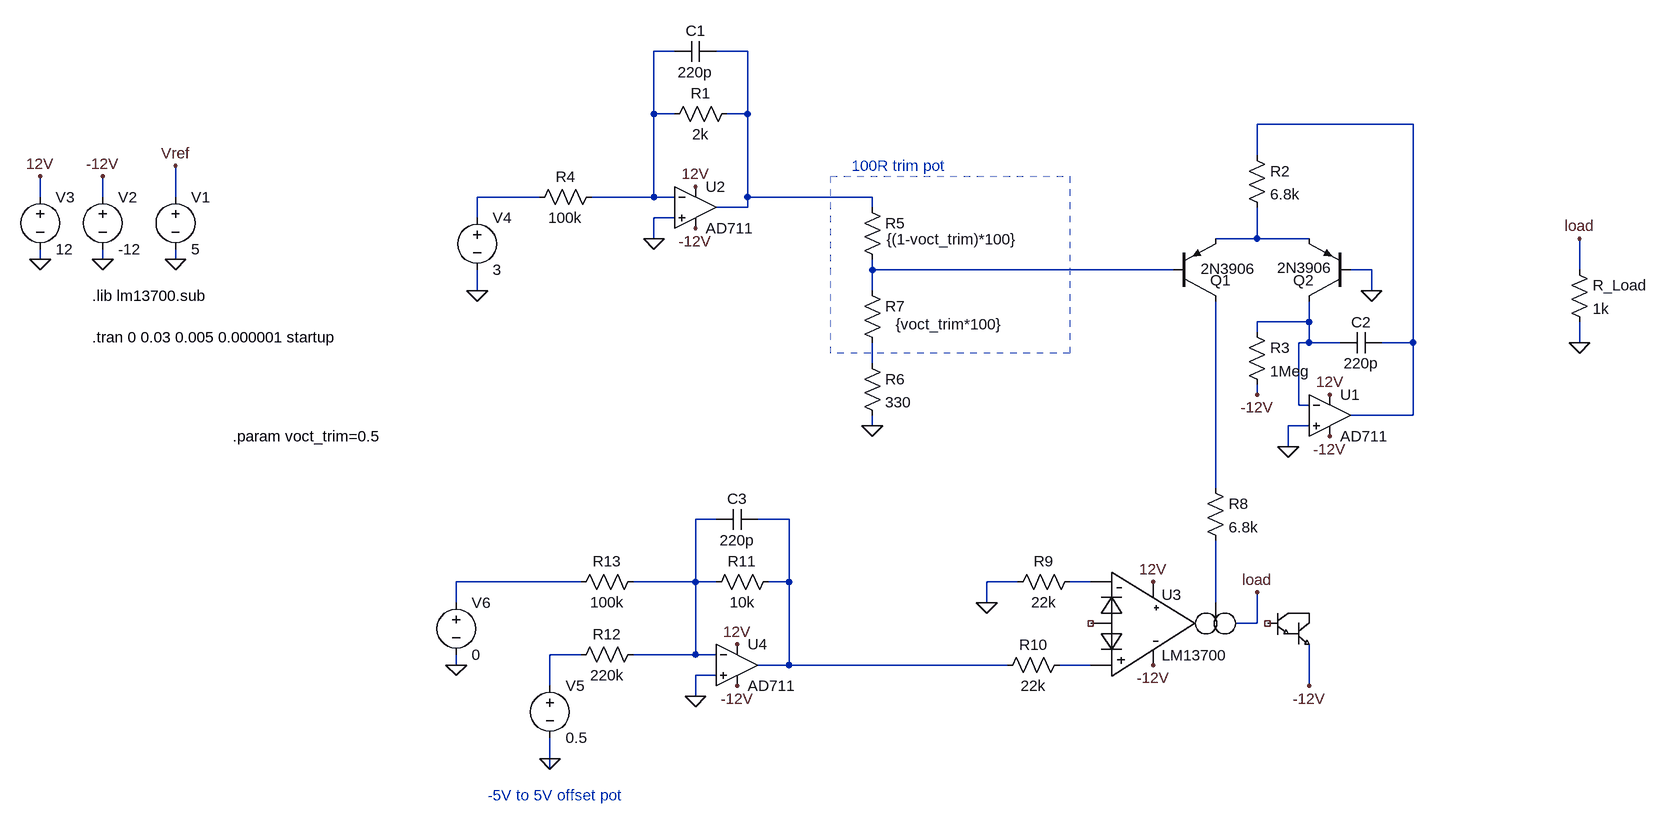
[diagram p0: schematic current source.asc]
current source.asc, the LTspice schematic file:
Version 4.1
SHEET 1 1984 984
WIRE 480 -176 448 -176
WIRE 592 -176 544 -176
WIRE 448 -80 448 -176
WIRE 480 -80 448 -80
WIRE 592 -80 592 -176
WIRE 592 -80 560 -80
WIRE 1616 -64 1376 -64
WIRE 1376 -16 1376 -64
WIRE -496 48 -496 16
WIRE -400 48 -400 16
WIRE -288 48 -288 0
WIRE 272 48 176 48
WIRE 448 48 448 -80
WIRE 448 48 352 48
WIRE 480 48 448 48
WIRE 592 48 592 -80
WIRE 784 48 592 48
WIRE 592 64 592 48
WIRE 592 64 544 64
WIRE 784 64 784 48
WIRE 176 80 176 48
WIRE 480 80 448 80
WIRE 448 112 448 80
WIRE 1376 112 1376 64
WIRE 1376 112 1312 112
WIRE 1456 112 1376 112
WIRE -496 144 -496 128
WIRE -400 144 -400 128
WIRE -288 144 -288 128
WIRE 784 160 784 144
WIRE 1248 160 784 160
WIRE 1552 160 1520 160
WIRE 1872 160 1872 112
WIRE 176 192 176 160
WIRE 784 192 784 160
WIRE 1552 192 1552 160
WIRE 1456 240 1456 208
WIRE 1456 240 1376 240
WIRE 1376 256 1376 240
WIRE 1456 272 1456 240
WIRE 1456 272 1440 272
WIRE 1504 272 1456 272
WIRE 1616 272 1616 -64
WIRE 1616 272 1568 272
WIRE 1872 272 1872 240
WIRE 784 304 784 272
WIRE 1376 352 1376 336
WIRE 1440 368 1440 272
WIRE 1456 368 1440 368
WIRE 1616 384 1616 272
WIRE 1616 384 1520 384
WIRE 784 400 784 384
WIRE 1456 400 1424 400
WIRE 1424 432 1424 400
WIRE 1312 496 1312 208
WIRE 544 544 512 544
WIRE 656 544 608 544
WIRE 336 640 144 640
WIRE 512 640 512 544
WIRE 512 640 416 640
WIRE 544 640 512 640
WIRE 656 640 656 544
WIRE 656 640 624 640
WIRE 1008 640 960 640
WIRE 1120 640 1088 640
WIRE 144 672 144 640
WIRE 960 672 960 640
WIRE 1312 672 1312 576
WIRE 1376 704 1376 656
WIRE 1376 704 1344 704
WIRE 336 752 288 752
WIRE 512 752 512 640
WIRE 512 752 416 752
WIRE 544 752 512 752
WIRE 144 768 144 752
WIRE 656 768 656 640
WIRE 656 768 608 768
WIRE 992 768 656 768
WIRE 1120 768 1072 768
WIRE 544 784 512 784
WIRE 288 800 288 752
WIRE 1456 800 1456 736
WIRE 512 816 512 784
WIRE 288 912 288 880
WIRE 288 928 288 912
FLAG -288 144 0
FLAG -288 0 Vref
FLAG -496 144 0
FLAG -400 144 0
FLAG -496 16 12V
FLAG -400 16 -12V
FLAG 512 96 -12V
FLAG 512 32 12V
FLAG 448 112 0
FLAG 784 400 0
FLAG 176 192 0
FLAG 1872 272 0
FLAG 1872 112 load
FLAG 1376 656 load
FLAG 1456 800 -12V
FLAG 1216 768 -12V
FLAG 1216 640 12V
FLAG 1552 192 0
FLAG 1488 416 -12V
FLAG 1488 352 12V
FLAG 1424 432 0
FLAG 1376 352 -12V
FLAG 576 800 -12V
FLAG 576 736 12V
FLAG 512 816 0
FLAG 960 672 0
FLAG 288 912 0
FLAG 144 768 0
SYMBOL voltage -288 32 R0
WINDOW 123 0 0 Left 0
WINDOW 39 0 0 Left 0
SYMATTR InstName V1
SYMATTR Value 5
SYMBOL voltage -400 32 R0
WINDOW 123 0 0 Left 0
WINDOW 39 0 0 Left 0
SYMATTR InstName V2
SYMATTR Value -12
SYMBOL voltage -496 32 R0
WINDOW 123 0 0 Left 0
WINDOW 39 0 0 Left 0
SYMATTR InstName V3
SYMATTR Value 12
SYMBOL OpAmps\\AD711 512 0 R0
SYMATTR InstName U2
SYMBOL res 368 32 R90
WINDOW 0 0 56 VBottom 2
WINDOW 3 32 56 VTop 2
SYMATTR InstName R4
SYMATTR Value 100k
SYMBOL res 768 48 R0
WINDOW 3 38 65 Left 2
SYMATTR InstName R5
SYMATTR Value {(1-voct_trim)*100}
SYMBOL res 768 288 R0
SYMATTR InstName R6
SYMATTR Value 330
SYMBOL res 768 176 R0
WINDOW 3 52 68 Left 2
SYMATTR InstName R7
SYMATTR Value {voct_trim*100}
SYMBOL voltage 176 64 R0
WINDOW 123 0 0 Left 0
WINDOW 39 0 0 Left 0
SYMATTR InstName V4
SYMATTR Value 3
SYMBOL res 1856 144 R0
SYMATTR InstName R_Load
SYMATTR Value 1k
SYMBOL LM13700 1184 624 R0
SYMATTR InstName U3
SYMBOL res 576 -96 R90
WINDOW 0 0 56 VBottom 2
WINDOW 3 32 56 VTop 2
SYMATTR InstName R1
SYMATTR Value 2k
SYMBOL cap 544 -192 R90
WINDOW 0 0 32 VBottom 2
WINDOW 3 32 32 VTop 2
SYMATTR InstName C1
SYMATTR Value 220p
SYMBOL pnp 1248 208 M180
WINDOW 3 41 50 Left 2
SYMATTR InstName Q1
SYMATTR Value 2N3906
SYMBOL pnp 1520 208 R180
WINDOW 3 28 51 Left 2
SYMATTR InstName Q2
SYMATTR Value 2N3906
SYMBOL res 1360 -32 R0
SYMATTR InstName R2
SYMATTR Value 6.8k
SYMBOL OpAmps\\AD711 1488 320 R0
SYMATTR InstName U1
SYMBOL cap 1568 256 R90
WINDOW 0 0 32 VBottom 2
WINDOW 3 32 32 VTop 2
SYMATTR InstName C2
SYMATTR Value 220p
SYMBOL res 1360 240 R0
SYMATTR InstName R3
SYMATTR Value 1Meg
SYMBOL res 1296 480 R0
SYMATTR InstName R8
SYMATTR Value 6.8k
SYMBOL OpAmps\\AD711 576 704 R0
SYMATTR InstName U4
SYMBOL res 1104 624 R90
WINDOW 0 0 56 VBottom 2
WINDOW 3 32 56 VTop 2
SYMATTR InstName R9
SYMATTR Value 22k
SYMBOL res 1088 752 R90
WINDOW 0 0 56 VBottom 2
WINDOW 3 32 56 VTop 2
SYMATTR InstName R10
SYMATTR Value 22k
SYMBOL res 640 624 R90
WINDOW 0 0 56 VBottom 2
WINDOW 3 32 56 VTop 2
SYMATTR InstName R11
SYMATTR Value 10k
SYMBOL cap 608 528 R90
WINDOW 0 0 32 VBottom 2
WINDOW 3 32 32 VTop 2
SYMATTR InstName C3
SYMATTR Value 220p
SYMBOL res 432 736 R90
WINDOW 0 0 56 VBottom 2
WINDOW 3 32 56 VTop 2
SYMATTR InstName R12
SYMATTR Value 220k
SYMBOL res 432 624 R90
WINDOW 0 0 56 VBottom 2
WINDOW 3 32 56 VTop 2
SYMATTR InstName R13
SYMATTR Value 100k
SYMBOL voltage 288 784 R0
WINDOW 123 0 0 Left 0
WINDOW 39 0 0 Left 0
SYMATTR InstName V5
SYMATTR Value 0.5
SYMBOL voltage 144 656 R0
WINDOW 123 0 0 Left 0
WINDOW 39 0 0 Left 0
SYMATTR InstName V6
SYMATTR Value 0
TEXT -416 264 Left 2 !.tran 0 0.03 0.005 0.000001 startup
TEXT -416 200 Left 2 !.lib lm13700.sub
TEXT -200 416 Left 2 !.param voct_trim=0.5
TEXT 752 0 Left 2 ;100R trim pot
TEXT 192 968 Left 2 ;-5V to 5V offset pot
RECTANGLE Normal 1088 288 720 16 2

The netlist it stands for:
* current source.asc
V1 Vref 0 5
V2 -12V 0 -12
V3 12V 0 12
X§U2 0 N001 12V -12V N002 AD712  ; AD711, pins In+ In- V+ V- OUT
R4 N001 N004 100k
R5 N002 N006 {(1-voct_trim)*100}
R6 N008 0 330
R7 N006 N008 {voct_trim*100}
V4 N004 0 3
R_Load load 0 1k
X§U3 NC_01 N016 N013 N014 load 12V -12V NC_02 -12V LM13700 HALF13700  ; pins LIN INP INN IAB ? VCC VSS BIN BUF
R1 N002 N001 2k
C1 N002 N001 220p
Q1 N009 N006 N005 0 2N3906
Q2 N007 0 N005 0 2N3906
R2 N003 N005 6.8k
X§U1 0 N007 12V -12V N003 AD712  ; AD711, pins In+ In- V+ V- OUT
C2 N003 N007 220p
R3 N007 -12V 1Meg
R8 N009 N014 6.8k
X§U4 0 N010 12V -12V N011 AD712  ; AD711, pins In+ In- V+ V- OUT
R9 N013 0 22k
R10 N016 N011 22k
R11 N011 N010 10k
C3 N011 N010 220p
R12 N010 N015 220k
R13 N010 N012 100k
V5 N015 0 0.5
V6 N012 0 0
.model NPN NPN
.model PNP PNP
.lib standard.bjt
.tran 0 0.03 0.005 0.000001 startup
.lib lm13700.sub
.param voct_trim=0.5
* 100R trim pot
* -5V to 5V offset pot
.lib ADI1.lib
.backanno
.end